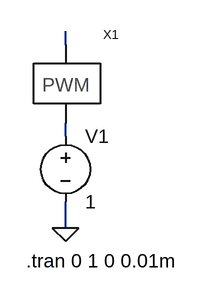
[diagram p0: schematic PWMtest.asc]
PWMtest.asc, the LTspice schematic file:
Version 4
SHEET 1 880 680
WIRE 112 32 112 16
WIRE 112 144 112 128
WIRE 112 256 112 224
FLAG 112 256 0
SYMBOL PWM 112 80 R0
WINDOW 39 54 4 Left 0
SYMATTR InstName X1
SYMBOL voltage 112 128 R0
WINDOW 123 0 0 Left 0
WINDOW 39 0 0 Left 0
SYMATTR InstName V1
SYMATTR Value 1
TEXT 64 296 Left 0 !.tran 0 1 0 0.01m

The netlist it stands for:
* PWMtest.asc
XX1 N001 N002 PWM  ; pins P N
V1 N002 0 1
.tran 0 1 0 0.01m
.backanno
.end